# EAGLE schematic untitled (EAGLE 7.6.0)
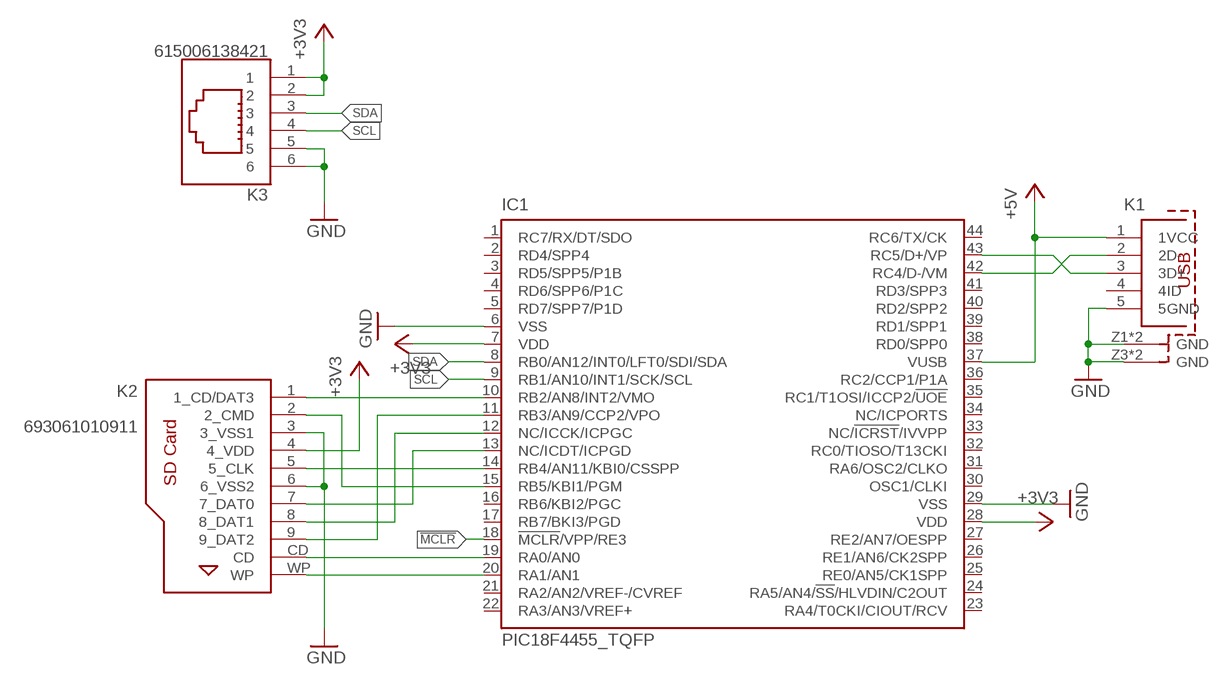
[diagram p0: schematic, sheet 1]

## Parts
IC1  PIC18F4455_TQFP  [TQFP44]
K1  629105150521  [629105150521]
K2  693061010911  [693061010911]
K3  615006138421  [615006138421]

## Nets
!MCLR: IC1.18(!MCLR!/VPP/RE3)
+3V3: IC1.7(VDD) IC1.28(VDD) K2.4(4_VDD) K3.1 K3.2
+5V: IC1.37(VUSB) K1.1(1VCC)
GND: IC1.6(VSS) IC1.29(VSS) K1.5(5GND) K1.Z1(GND) K1.Z2(GND) K1.Z3(GND) K1.Z4(GND) K2.3(3_VSS1) K2.6(6_VSS2) K3.5 K3.6
N$1: IC1.10(RB2/AN8/INT2/VMO) K2.1(1_CD/DAT3)
N$2: IC1.11(RB3/AN9/CCP2/VPO) K2.9(9_DAT2)
N$3: IC1.12(NC/ICCK/ICPGC) K2.8(8_DAT1)
N$4: IC1.13(NC/ICDT/ICPGD) K2.7(7_DAT0)
N$5: IC1.14(RB4/AN11/KBI0/CSSPP) K2.5(5_CLK)
N$6: IC1.19(RA0/AN0) K2.CD
N$7: IC1.43(RC5/D+/VP) K1.3(3D+)
N$8: IC1.42(RC4/D-/VM) K1.2(2D-)
N$9: IC1.15(RB5/KBI1/PGM) K2.2(2_CMD)
N$10: IC1.20(RA1/AN1) K2.WP
SCL: IC1.9(RB1/AN10/INT1/SCK/SCL) K3.4
SDA: IC1.8(RB0/AN12/INT0/LFT0/SDI/SDA) K3.3
Unconnected: IC1.1(RC7/RX/DT/SDO) IC1.2(RD4/SPP4) IC1.3(RD5/SPP5/P1B) IC1.4(RD6/SPP6/P1C) IC1.5(RD7/SPP7/P1D) IC1.16(RB6/KBI2/PGC) IC1.17(RB7/BKI3/PGD) IC1.21(RA2/AN2/VREF-/CVREF) IC1.22(RA3/AN3/VREF+) IC1.23(RA4/T0CKI/CIOUT/RCV) IC1.24(RA5/AN4/!SS!/HLVDIN/C2OUT) IC1.25(RE0/AN5/CK1SPP) IC1.26(RE1/AN6/CK2SPP) IC1.27(RE2/AN7/OESPP) IC1.30(OSC1/CLKI) IC1.31(RA6/OSC2/CLKO) IC1.32(RC0/TIOSO/T13CKI) IC1.33(NC/!ICRST!/IVVPP) IC1.34(NC/ICPORTS) IC1.35(RC1/T1OSI/ICCP2/!UOE) IC1.36(RC2/CCP1/P1A) IC1.38(RD0/SPP0) IC1.39(RD1/SPP1) IC1.40(RD2/SPP2) IC1.41(RD3/SPP3) IC1.44(RC6/TX/CK) K1.4(4ID)

## Library data of the parts
IC1 = microchip:PIC18F4*_TQFP: USB Microcontrollers with nanoWatt Technology High-Performance, Enhanced Flash, 28/40/44-Pin, Source: http://ww1.microchip.com/downloads/en/devicedoc/39632c.pdf; MF: MICROCHIP; MPN: PIC18F4455-I/PT; OC_FARNELL: 9321322; OC_NEWARK: 08J9628
K1 = Input-Output_Connectors_rev15d:629105150521: WR-COM_USB_Micro Type B_Horizontal_SMT ; Micro Type B Horizontal SMT - 3A current at Pin1 & Pin 5 - with Pegs and THT shielding Pins - T&R Packaging Code : Con_I-O_COM_USB_2.0_B_629105150521_629105150521 <http://katalog.we-online.de/media/images/eican/Con_I-O_COM_USB_2.0_B_629105150521_pf2.jpg> Details see: http://katalog.we-online.de/em/datasheet/629105150521.pdf Created 12/08/2014, Dan Xu 2014 (C) Wurth Elektronik
K2 = Input-Output_Connectors_rev15d:693061010911: WR-CRD SD CARD CONNECTOR PUSH & PUSH WITH CARD DETECTION 9 PINS=>Code : Con_I-O_COM_CRD_SD_Normal_693061010911 <http://katalog.we-online.de/media/images/eican/Con_I-O_COM_CRD_SD_Normal_693061010911_pf2.jpg> Details see: http://katalog.we-online.de/en/em/693_061_010_911 Created 2014-07-09, Karrer Zheng 2014 (C) Würth Elektronik
K3 = Input-Output_Connectors_rev15d:615006138421: WR-MJ Horizontal Plastic 6P6C Modular Jack Tab Up, 6 Pins=>Code : Con_I-O_MJ-H_Plastic_Up_615006138421 <http://katalog.we-online.de/media/images/eican/Con_I-O_MJ-H_Plastic_Up_6150xx138421_pf2.jpg> Details see: http://katalog.we-online.de/en/em/615_0xx_138_121 Created 2014-07-10, Karrer Zheng 2014 (C) Würth Elektronik